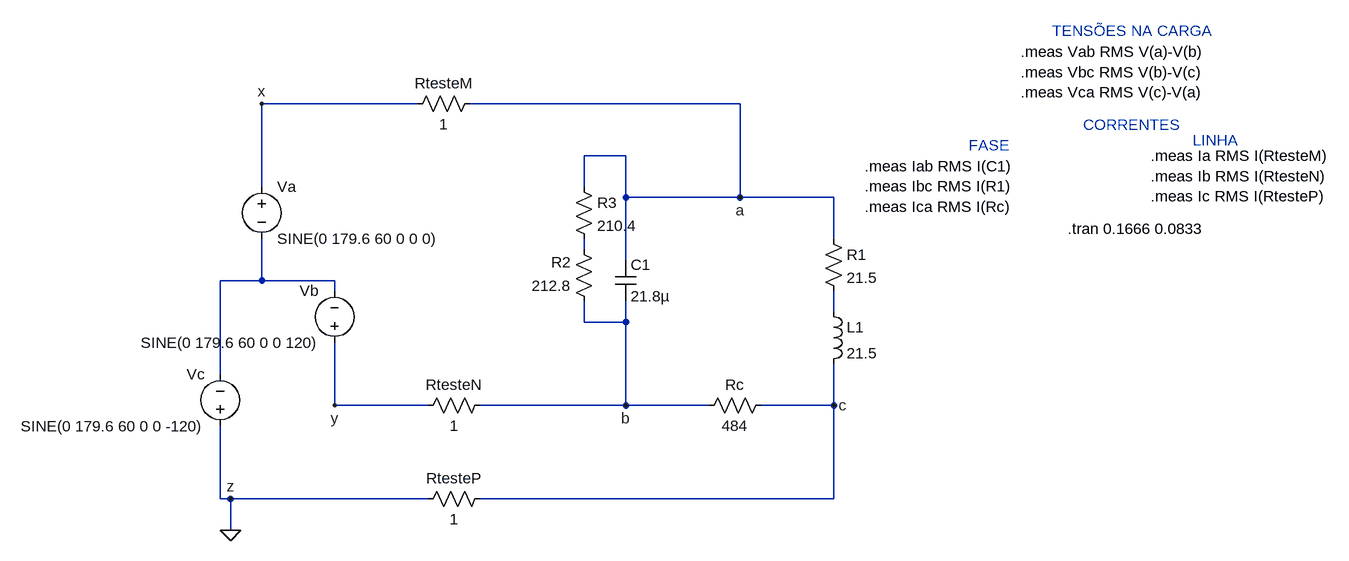
[diagram p0: schematic Y - delta des.asc]
Y - delta des.asc, the LTspice schematic file:
Version 4.1
SHEET 1 1680 680
WIRE 256 -64 16 -64
WIRE 752 -64 336 -64
WIRE 576 16 512 16
WIRE 16 64 16 -64
WIRE 512 64 512 16
WIRE 576 80 576 16
WIRE 752 80 752 -64
WIRE 752 80 576 80
WIRE 896 80 752 80
WIRE 896 144 896 80
WIRE 512 160 512 144
WIRE 576 176 576 80
WIRE 16 208 16 144
WIRE 16 208 -48 208
WIRE 128 208 16 208
WIRE 128 224 128 208
WIRE 896 256 896 224
WIRE 512 272 512 240
WIRE 576 272 576 240
WIRE 576 272 512 272
WIRE -48 352 -48 208
WIRE 128 400 128 304
WIRE 272 400 128 400
WIRE 576 400 576 272
WIRE 576 400 352 400
WIRE 704 400 576 400
WIRE 896 400 896 336
WIRE 896 400 784 400
WIRE -48 544 -48 432
WIRE -32 544 -48 544
WIRE 272 544 -32 544
WIRE 896 544 896 400
WIRE 896 544 352 544
WIRE -32 592 -32 544
FLAG 752 80 a
FLAG 576 400 b
FLAG 896 400 c
FLAG 16 -64 x
FLAG 128 400 y
FLAG -32 544 z
FLAG -32 592 0
SYMBOL voltage 16 48 R0
WINDOW 123 0 0 Left 0
WINDOW 39 0 0 Left 0
SYMATTR InstName Va
SYMATTR Value SINE(0 179.6 60 0 0 0)
SYMBOL voltage 128 320 R180
WINDOW 0 24 96 Left 2
WINDOW 3 24 16 Left 2
WINDOW 123 0 0 Left 0
WINDOW 39 0 0 Left 0
SYMATTR InstName Vb
SYMATTR Value SINE(0 179.6 60 0 0 120)
SYMBOL voltage -48 448 R180
WINDOW 0 24 96 Left 2
WINDOW 3 24 16 Left 2
WINDOW 123 0 0 Left 0
WINDOW 39 0 0 Left 0
SYMATTR InstName Vc
SYMATTR Value SINE(0 179.6 60 0 0 -120)
SYMBOL res 352 -80 R90
WINDOW 0 0 56 VBottom 2
WINDOW 3 32 56 VTop 2
SYMATTR InstName RtesteM
SYMATTR Value 1
SYMBOL res 368 384 R90
WINDOW 0 0 56 VBottom 2
WINDOW 3 32 56 VTop 2
SYMATTR InstName RtesteN
SYMATTR Value 1
SYMBOL res 368 528 R90
WINDOW 0 0 56 VBottom 2
WINDOW 3 32 56 VTop 2
SYMATTR InstName RtesteP
SYMATTR Value 1
SYMBOL res 800 384 R90
WINDOW 0 0 56 VBottom 2
WINDOW 3 32 56 VTop 2
SYMATTR InstName Rc
SYMATTR Value 484
SYMBOL cap 560 176 R0
SYMATTR InstName C1
SYMATTR Value 21.8µ
SYMBOL res 496 48 R0
SYMATTR InstName R3
SYMATTR Value 210.4
SYMBOL res 528 256 R180
WINDOW 0 36 76 Left 2
WINDOW 3 36 40 Left 2
SYMATTR InstName R2
SYMATTR Value 212.8
SYMBOL res 880 128 R0
SYMATTR InstName R1
SYMATTR Value 21.5
SYMBOL ind 880 240 R0
SYMATTR InstName L1
SYMATTR Value 21.5
TEXT 1232 -176 Left 2 ;TENSÕES NA CARGA
TEXT 1184 -144 Left 2 !.meas Vab RMS V(a)-V(b)\n.meas Vbc RMS V(b)-V(c)\n.meas Vca RMS V(c)-V(a)
TEXT 1280 -32 Left 2 ;CORRENTES
TEXT 1104 0 Left 2 ;FASE
TEXT 944 32 Left 2 !.meas Iab RMS I(C1)\n.meas Ibc RMS I(R1)\n.meas Ica RMS I(Rc)
TEXT 1448 -8 Left 2 ;LINHA
TEXT 1384 16 Left 2 !.meas Ia RMS I(RtesteM)\n.meas Ib RMS I(RtesteN)\n.meas Ic RMS I(RtesteP)
TEXT 1256 128 Left 2 !.tran 0.1666 0.0833

The netlist it stands for:
* Y - delta des.asc
Va x N002 SINE(0 179.6 60 0 0 0)
Vb y N002 SINE(0 179.6 60 0 0 120)
Vc 0 N002 SINE(0 179.6 60 0 0 -120)
RtesteM a x 1
RtesteN b y 1
RtesteP c 0 1
Rc c b 484
C1 a b 21.8µ
R3 a N001 210.4
R2 b N001 212.8
R1 a N003 21.5
L1 N003 c 21.5
* TENSÕES NA CARGA
.meas Vab RMS V(a)-V(b)
.meas Vbc RMS V(b)-V(c)
.meas Vca RMS V(c)-V(a)
* CORRENTES
* FASE
.meas Iab RMS I(C1)
.meas Ibc RMS I(R1)
.meas Ica RMS I(Rc)
* LINHA
.meas Ia RMS I(RtesteM)
.meas Ib RMS I(RtesteN)
.meas Ic RMS I(RtesteP)
.tran 0.1666 0.0833
.backanno
.end

* Results of the author's LTspice run, read from the files saved beside the schematic
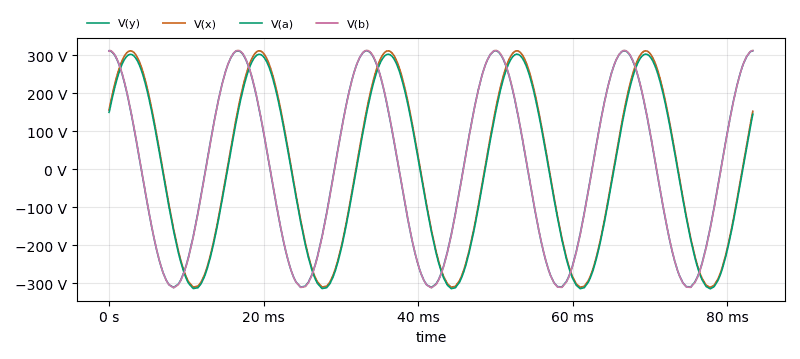
[diagram p1: Transient Analysis of Y - delta des.asc, plotted from the saved traces]
* Transient Analysis, 1 run:
*   V(y): min -311.1 V, max 311.1 V, average -597.2 µV, rms 219.9 V, last 311.1 V
*   V(x): min -311.1 V, max 311.1 V, average 110.5 mV, rms 220 V, last 152.1 V
*   V(a): min -314.6 V, max 302.3 V, average -6.222 V, rms 218.2 V, last 144.3 V
*   V(b): min -312.2 V, max 312.2 V, average -2.653 mV, rms 220.7 V, last 312.2 V
* From the log:
*   vab: RMS(V(a)-V(b))=218.690004227 FROM 0 TO 0.0833
*   vbc: RMS(V(b)-V(c))=220.361900685 FROM 0 TO 0.0833
*   vca: RMS(V(c)-V(a))=218.194493381 FROM 0 TO 0.0833
*   iab: RMS(I(C1))=1.79539841104 FROM 0 TO 0.0833
*   ibc: RMS(I(R1))=6.34985520075 FROM 0 TO 0.0833
*   ica: RMS(I(Rc))=0.455293182769 FROM 0 TO 0.0833
*   ia: RMS(I(RtesteM))=6.60636529683 FROM 0 TO 0.0833
*   ib: RMS(I(RtesteN))=1.59047421459 FROM 0 TO 0.0833
*   ic: RMS(I(RtesteP))=6.35113653099 FROM 0 TO 0.0833